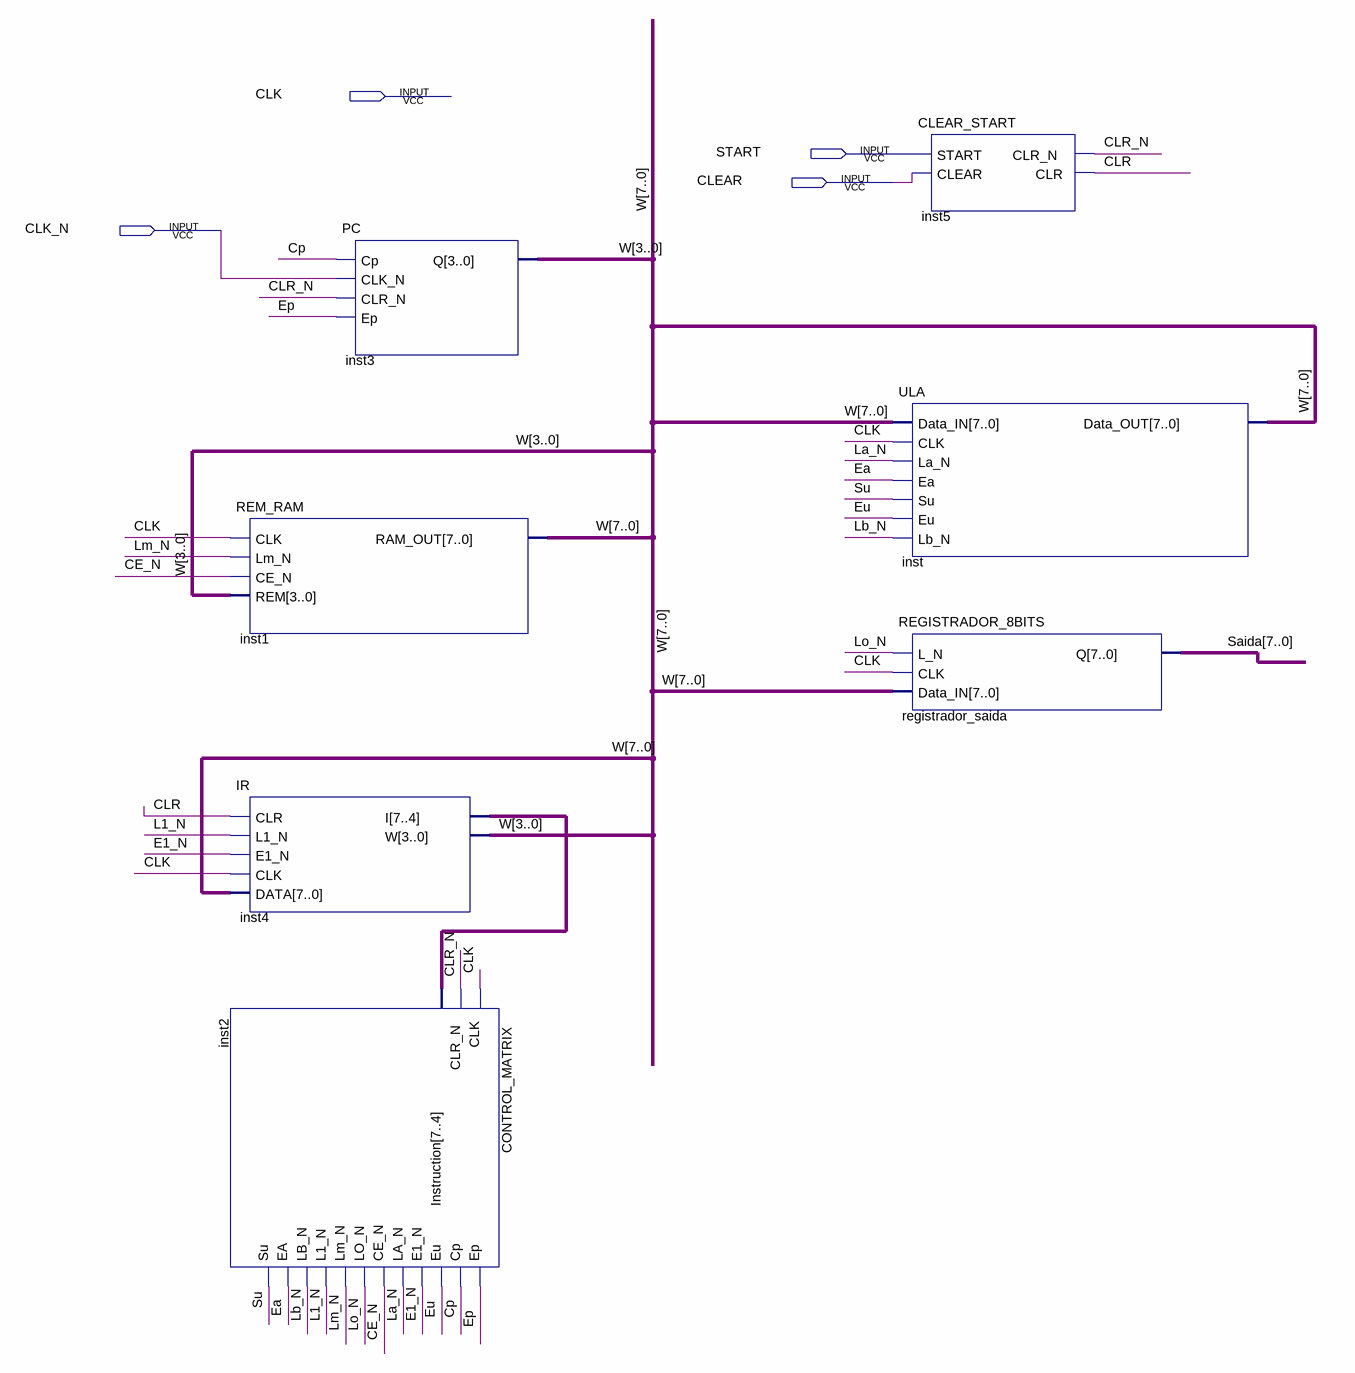
[diagram p0: schematic sheet]
// Quartus schematic uPC.bdf as structural Verilog: 7 symbols, 4 pins
module uPC (
  input  CLK,
  input  START,
  input  CLEAR,
  input  CLK_N
);

  wire CE_N, CLR, CLR_N, Cp, E1_N, Ea, Ep, Eu, L1_N, La_N, Lb_N, Lm_N, Lo_N, Su;
  wire [3:0] inst4_i;
  wire [7:0] Saida, W;

  CONTROL_MATRIX inst2 (
    .CLK(CLK), .CLR_N(CLR_N), .Instruction(inst4_i), .Ep(Ep), .Cp(Cp), .Eu(Eu), .E1_N(E1_N), .LA_N(La_N),
    .CE_N(CE_N), .LO_N(Lo_N), .Lm_N(Lm_N), .L1_N(L1_N), .LB_N(Lb_N), .EA(Ea), .Su(Su));
  REM_RAM inst1 (.CLK(CLK), .Lm_N(Lm_N), .CE_N(CE_N), .REM(W[3:0]), .RAM_OUT(W));
  IR inst4 (.CLR(CLR), .L1_N(L1_N), .E1_N(E1_N), .CLK(CLK), .DATA(W), .I(inst4_i), .W(W[3:0]));
  PC inst3 (.Cp(Cp), .CLK_N(CLK_N), .CLR_N(CLR_N), .Ep(Ep), .Q(W[3:0]));
  CLEAR_START inst5 (.START(START), .CLEAR(CLEAR), .CLR_N(CLR_N), .CLR(CLR));
  ULA inst (.Data_IN(W), .CLK(CLK), .La_N(La_N), .Ea(Ea), .Su(Su), .Eu(Eu), .Lb_N(Lb_N), .Data_OUT(W));
  REGISTRADOR_8BITS registrador_saida (.L_N(Lo_N), .CLK(CLK), .Data_IN(W), .Q(Saida));
endmodule
